# Altium schematic sheet mcu.SchDoc
size A4; SheetNumber: 5; SheetTotal: 5
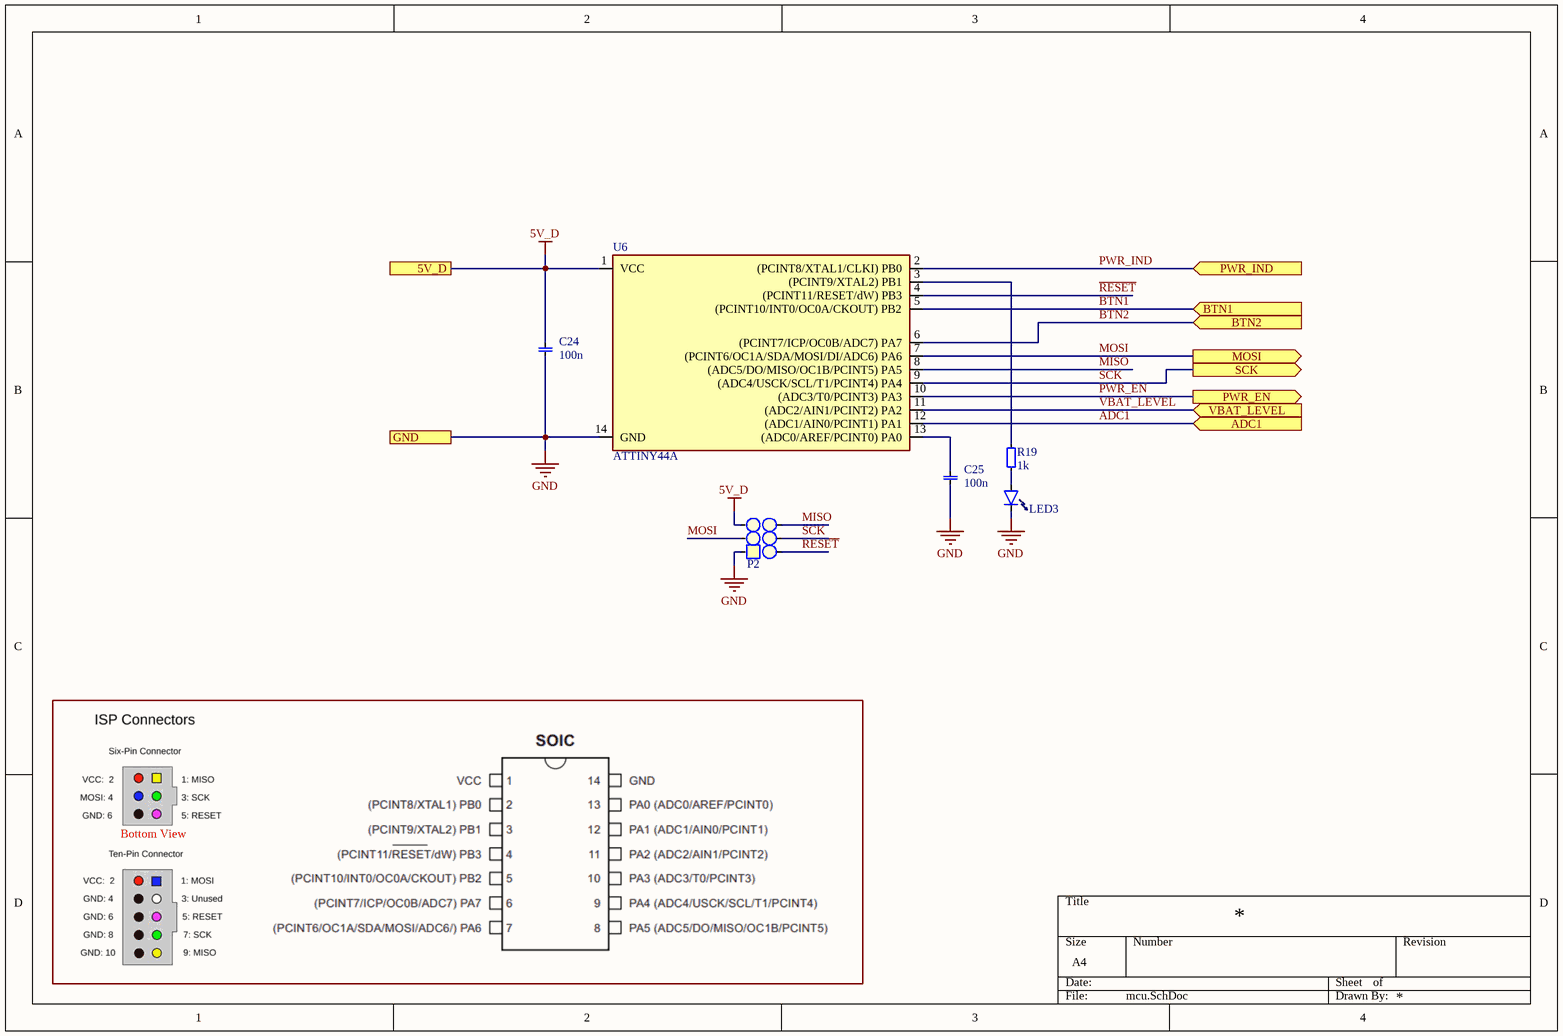
[diagram p0: mcu.SchDoc]

## Parts
C24  value 100n  [0603 cap]  (hidden comment: 0603, capacitor)
C25  value 100n  [0603 cap]  (hidden comment: 0603, capacitor)
LED3  0805, LED  [0805_led]  (value not drawn)
P2  2x3 Pin Header  [2x3 PH]  (value not drawn)
R19  value 1k  [0603]  (hidden comment: 0603, resistor)
U6  ATTINY44A  [DIP14]

## Ports
5V_D, ADC1 (in), BTN1 (in), BTN2 (in), GND, MOSI (out), PWR_EN (out), PWR_IND (in), SCK (out), VBAT_LEVEL (in)

## Nets
5V_D: C24.1 P2.3 U6.1(VCC) ; port 5V_D
GND: C24.0 C25.0 LED3.0(Cathode) P2.1 U6.14(GND) ; port GND
ADC1: U6.12((ADC1/AIN0/PCINT1)_PA1) ; port ADC1
BTN1: U6.5((PCINT10/INT0/OC0A/CKOUT)_PB2) ; port BTN1
BTN2: U6.6((PCINT7/ICP/OC0B/ADC7)_PA7) ; port BTN2
MISO: P2.4 U6.8((ADC5/DO/MISO/OC1B/PCINT5)_PA5)
MOSI: P2.2 U6.7((PCINT6/OC1A/SDA/MOSI/DI/ADC6)_PA6) ; port MOSI
PWR_EN: U6.10((ADC3/T0/PCINT3)_PA3) ; port PWR_EN
PWR_IND: U6.2((PCINT8/XTAL1/CLKI)_PB0) ; port PWR_IND
~{RESET}: P2.6 U6.4((PCINT11/RESET/dW)_PB3)
SCK: P2.5 U6.9((ADC4/USCK/SCL/T1/PCINT4)_PA4) ; port SCK
VBAT_LEVEL: U6.11((ADC2/AIN1/PCINT2)_PA2) ; port VBAT_LEVEL
NetC25_1: C25.1 U6.13((ADC0/AREF/PCINT0)_PA0)
NetLED3_1: LED3.1 R19.0
NetR19_1: R19.1 U6.3((PCINT9/XTAL2)_PB1)

## Notes on the sheet
- Bottom View

## Library data of the parts
C24 C25 = 0603, capacitor: Manufacturer Part Number: CC0603KRX7R9BB102; JLCPCB Part #: C14663; Mount: Yes
LED3 = 0805, LED: Manufacturer Part Number: KP-2012SURCK; Value: 0805 LED; JLCPCB Part #: C2295; Mount: Yes
P2 = 2x3 Pin Header: Value: 2x3 Pin Header, 2.54mm; Mount: No
R19 = 0603, resistor: Manufacturer Part Number: CR0603-FX-1001ELF; JLCPCB Part #: C21190; Mount: Yes
U6 = ATTINY44A: 8-bit microcontrollers based on the AVR® enhanced RISC / architecture.; JLCPCB Part #: C2325; Mount: Yes